# Altium schematic sheet Servo and Encoders.SchDoc
size Letter; DrawnBy: Kyle Hong
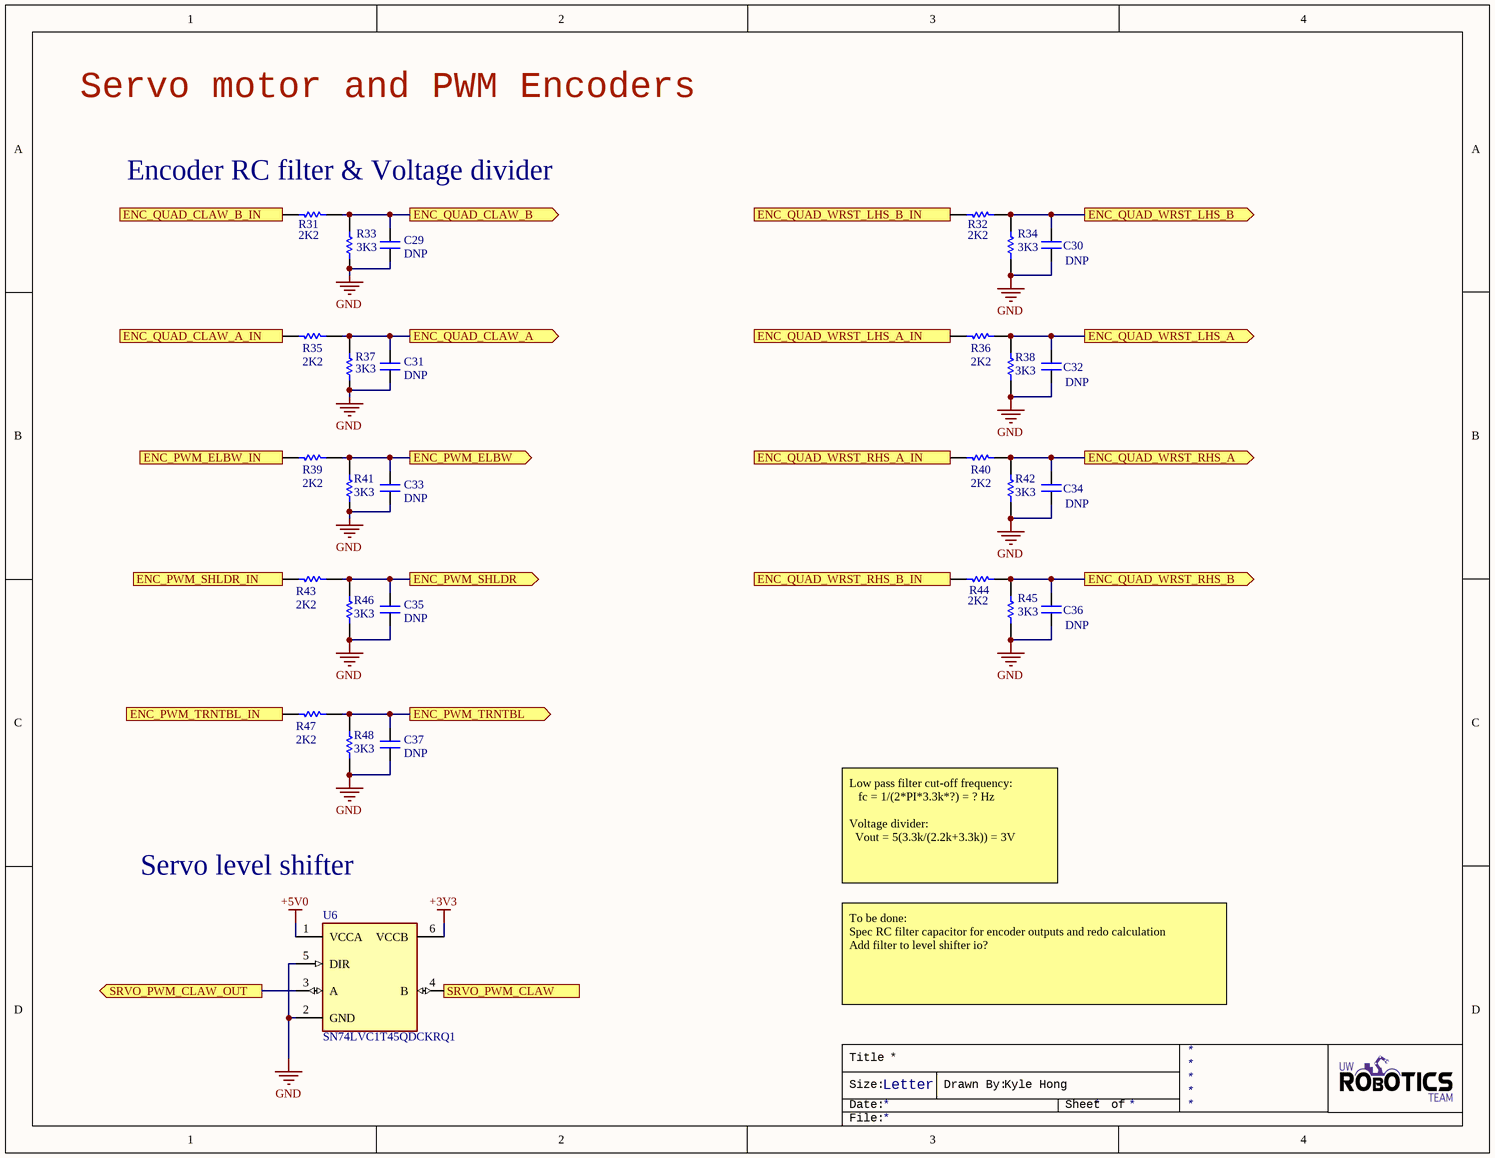
[diagram p0: Servo and Encoders.SchDoc]

## Parts
C29  value DNP  [CAPC0603(1608)55_N]  (hidden comment: CAP_DNP_0603_1_1)
C30  value DNP  [CAPC0603(1608)55_N]  (hidden comment: CAP_DNP_0603_1_1)
C31  value DNP  [CAPC0603(1608)55_N]  (hidden comment: CAP_DNP_0603_1_1)
C32  value DNP  [CAPC0603(1608)55_N]  (hidden comment: CAP_DNP_0603_1_1)
C33  value DNP  [CAPC0603(1608)55_N]  (hidden comment: CAP_DNP_0603_1_1)
C34  value DNP  [CAPC0603(1608)55_N]  (hidden comment: CAP_DNP_0603_1_1)
C35  value DNP  [CAPC0603(1608)55_N]  (hidden comment: CAP_DNP_0603_1_1)
C36  value DNP  [CAPC0603(1608)55_N]  (hidden comment: CAP_DNP_0603_1_1)
C37  value DNP  [CAPC0603(1608)55_N]  (hidden comment: CAP_DNP_0603_1_1)
R31  value 2K2  [RESC0603(1608)_N]  (hidden comment: RES_2K2_0603)
R32  value 2K2  [RESC0603(1608)_N]  (hidden comment: RES_2K2_0603)
R33  value 3K3  [RESC0603(1608)_N]  (hidden comment: RES_3K3_0603)
R34  value 3K3  [RESC0603(1608)_N]  (hidden comment: RES_3K3_0603)
R35  value 2K2  [RESC0603(1608)_N]  (hidden comment: RES_2K2_0603)
R36  value 2K2  [RESC0603(1608)_N]  (hidden comment: RES_2K2_0603)
R37  value 3K3  [RESC0603(1608)_N]  (hidden comment: RES_3K3_0603)
R38  value 3K3  [RESC0603(1608)_N]  (hidden comment: RES_3K3_0603)
R39  value 2K2  [RESC0603(1608)_N]  (hidden comment: RES_2K2_0603)
R40  value 2K2  [RESC0603(1608)_N]  (hidden comment: RES_2K2_0603)
R41  value 3K3  [RESC0603(1608)_N]  (hidden comment: RES_3K3_0603)
R42  value 3K3  [RESC0603(1608)_N]  (hidden comment: RES_3K3_0603)
R43  value 2K2  [RESC0603(1608)_N]  (hidden comment: RES_2K2_0603)
R44  value 2K2  [RESC0603(1608)_N]  (hidden comment: RES_2K2_0603)
R45  value 3K3  [RESC0603(1608)_N]  (hidden comment: RES_3K3_0603)
R46  value 3K3  [RESC0603(1608)_N]  (hidden comment: RES_3K3_0603)
R47  value 2K2  [RESC0603(1608)_N]  (hidden comment: RES_2K2_0603)
R48  value 3K3  [RESC0603(1608)_N]  (hidden comment: RES_3K3_0603)
U6  SN74LVC1T45QDCKRQ1  [SOT65P210X110-6N]

## Ports
ENC_PWM_ELBW (out), ENC_PWM_ELBW_IN (in), ENC_PWM_SHLDR (out), ENC_PWM_SHLDR_IN (in), ENC_PWM_TRNTBL (out), ENC_PWM_TRNTBL_IN (in), ENC_QUAD_CLAW_A (out), ENC_QUAD_CLAW_A_IN (in), ENC_QUAD_CLAW_B (out), ENC_QUAD_CLAW_B_IN (in), ENC_QUAD_WRST_LHS_A (out), ENC_QUAD_WRST_LHS_A_IN (in), ENC_QUAD_WRST_LHS_B (out), ENC_QUAD_WRST_LHS_B_IN (in), ENC_QUAD_WRST_RHS_A (out), ENC_QUAD_WRST_RHS_A_IN (in), ENC_QUAD_WRST_RHS_B (out), ENC_QUAD_WRST_RHS_B_IN (in), SRVO_PWM_CLAW (in), SRVO_PWM_CLAW_OUT (out)

## Nets
+3V3: U6.6(VCCB)
+5V0: U6.1(VCCA)
GND: C29.1 C30.1 C31.1 C32.1 C33.1 C34.1 C35.1 C36.1 C37.1 R33.1 R34.1 R37.1 R38.1 R41.1 R42.1 R45.1 R46.1 R48.1 U6.2(GND) U6.5(DIR)
ENC_PWM_ELBW: C33.2 R39.1 R41.2 ; port ENC_PWM_ELBW
ENC_PWM_ELBW_IN: R39.2 ; port ENC_PWM_ELBW_IN
ENC_PWM_SHLDR: C35.2 R43.1 R46.2 ; port ENC_PWM_SHLDR
ENC_PWM_SHLDR_IN: R43.2 ; port ENC_PWM_SHLDR_IN
ENC_PWM_TRNTBL: C37.2 R47.1 R48.2 ; port ENC_PWM_TRNTBL
ENC_PWM_TRNTBL_IN: R47.2 ; port ENC_PWM_TRNTBL_IN
ENC_QUAD_CLAW_A: C31.2 R35.1 R37.2 ; port ENC_QUAD_CLAW_A
ENC_QUAD_CLAW_A_IN: R35.2 ; port ENC_QUAD_CLAW_A_IN
ENC_QUAD_CLAW_B: C29.2 R31.1 R33.2 ; port ENC_QUAD_CLAW_B
ENC_QUAD_CLAW_B_IN: R31.2 ; port ENC_QUAD_CLAW_B_IN
ENC_QUAD_WRST_LHS_A: C32.2 R36.1 R38.2 ; port ENC_QUAD_WRST_LHS_A
ENC_QUAD_WRST_LHS_A_IN: R36.2 ; port ENC_QUAD_WRST_LHS_A_IN
ENC_QUAD_WRST_LHS_B: C30.2 R32.1 R34.2 ; port ENC_QUAD_WRST_LHS_B
ENC_QUAD_WRST_LHS_B_IN: R32.2 ; port ENC_QUAD_WRST_LHS_B_IN
ENC_QUAD_WRST_RHS_A: C34.2 R40.1 R42.2 ; port ENC_QUAD_WRST_RHS_A
ENC_QUAD_WRST_RHS_A_IN: R40.2 ; port ENC_QUAD_WRST_RHS_A_IN
ENC_QUAD_WRST_RHS_B: C36.2 R44.1 R45.2 ; port ENC_QUAD_WRST_RHS_B
ENC_QUAD_WRST_RHS_B_IN: R44.2 ; port ENC_QUAD_WRST_RHS_B_IN
SRVO_PWM_CLAW: U6.4(B) ; port SRVO_PWM_CLAW
SRVO_PWM_CLAW_OUT: U6.3(A) ; port SRVO_PWM_CLAW_OUT

## Notes on the sheet
- Servo motor and PWM Encoders
- Encoder RC filter & Voltage divider
- Servo level shifter
- Low pass filter cut-off frequency:
  fc = 1/(2*PI*3.3k*?) = ? Hz
  Voltage divider:
  Vout = 5(3.3k/(2.2k+3.3k)) = 3V
- To be done:
  Spec RC filter capacitor for encoder outputs and redo calculation
  Add filter to level shifter io?
- Title
- Size:
- Date:
- Letter
- Drawn By:
- Sheet
- of
- File:

## Library data of the parts
C29-C37 = CAP_DNP_0603_1_1: CAP DNP 0603; Dimensions: 0.063" L x 0.031" W (1.60mm x 0.80mm); Package: 0603 (1608 Metric)
R31 R32 R35 R36 R39 R40 R43 R44 R47 = RES_2K2_0603: RES SMD 2.2K OHM 1% 1/10W 0603; Manufacturer: Yageo; MPN: RC0603FR-072K2L; Dimensions: 0.063" L x 0.031" W (1.60mm x 0.80mm); Package: 0603 (1608 Metric); Tolerance: 1%; Supplier 1: Digi-Key; Supplier Part Number 1: 311-2.20KHRCT-ND
R33 R34 R37 R38 R41 R42 R45 R46 R48 = RES_3K3_0603: RES SMD 3.3K OHM 5% 1/10W 0603; Manufacturer: Yageo; MPN: RC0603JR-073K3L; Dimensions: 0.063" L x 0.031" W (1.60mm x 0.80mm); Package: 0603 (1608 Metric); Tolerance: 5%; Supplier Part Number 1: 311-3.3KGRCT-ND; Supplier 1: Digi-Key; Digikey Part Number: 311-3.3KGRCT-ND
U6 = IC_LVL_SHIFTER_TI: IC BIDIRECTIONAL LEVEL SHIFTER; Manufacturer 1: Texas Instruments; Data Rate: 420Mbps; Number of Channels: 1; Logic Function: Translator; Turn-On Delay Time: 6.9ns; High Level Output Current: -32mA; Low Level Output Current: 32mA; Quiescent Current: 10uA; Max Supply Voltage: 5.5V; Min Supply Voltage: 1.65V; Supplier 1: Digi-Key; Manufacturer Part Number 1: SN74LVC1T45QDCKRQ1; Stock 1: 7633; Pricing 1: 1=0.59000, 10=0.51500, 25=0.48360, 100=0.39470, 250=0.36660, 500=0.31200, 1000=0.24960 (USD); RoHS: Yes; Mount: Surface Mount; Case/Package: SC; Number of Pins: 6; Weight: 0.000988oz; Min Operating Temperature: -40°C; Max Operating Temperature: 125°C; Number of Bits: 1; Channel Type: Bidirectional; Number of Circuits: 1; Packaging: Tape and Reel; Propagation Delay: 6.9ns; Package Quantity: 3000; Radiation Hardening: No; Lead Free: Lead Free; REACH SVHC: No SVHC; ComponentLink1URL: https://datasheet.ciiva.com/6615/sn74lvc1t45-q1-6615008.pdf?src-supplier=Digi-Key; ComponentLink1Description: https://datasheet.ciiva.com/6615/sn74lvc1t45-q1-6615008.pdf?src-supplier=Digi-Key; ComponentLink2URL: https://datasheet.ciiva.com/12072/sces677b-213901-12072996.pdf?src-supplier=Mouser; ComponentLink2Description: https://datasheet.ciiva.com/12072/sces677b-213901-12072996.pdf?src-supplier=Mouser; ComponentLink3URL: https://datasheet.ciiva.com/15096/getdatasheetpartid-701994-15096516.pdf?src-supplier=Verical; ComponentLink3Description: https://datasheet.ciiva.com/15096/getdatasheetpartid-701994-15096516.pdf?src-supplier=Verical; ComponentLink4URL: https://datasheet.ciiva.com/29887/sn74lvc1t45-q1-29887614.pdf?src-supplier=Avnet; ComponentLink4Description: https://datasheet.ciiva.com/29887/sn74lvc1t45-q1-29887614.pdf?src-supplier=Avnet; Supplier Part Number 1: 296-39212-1-ND